# Altium project ad7768_testboard.PrjPcb
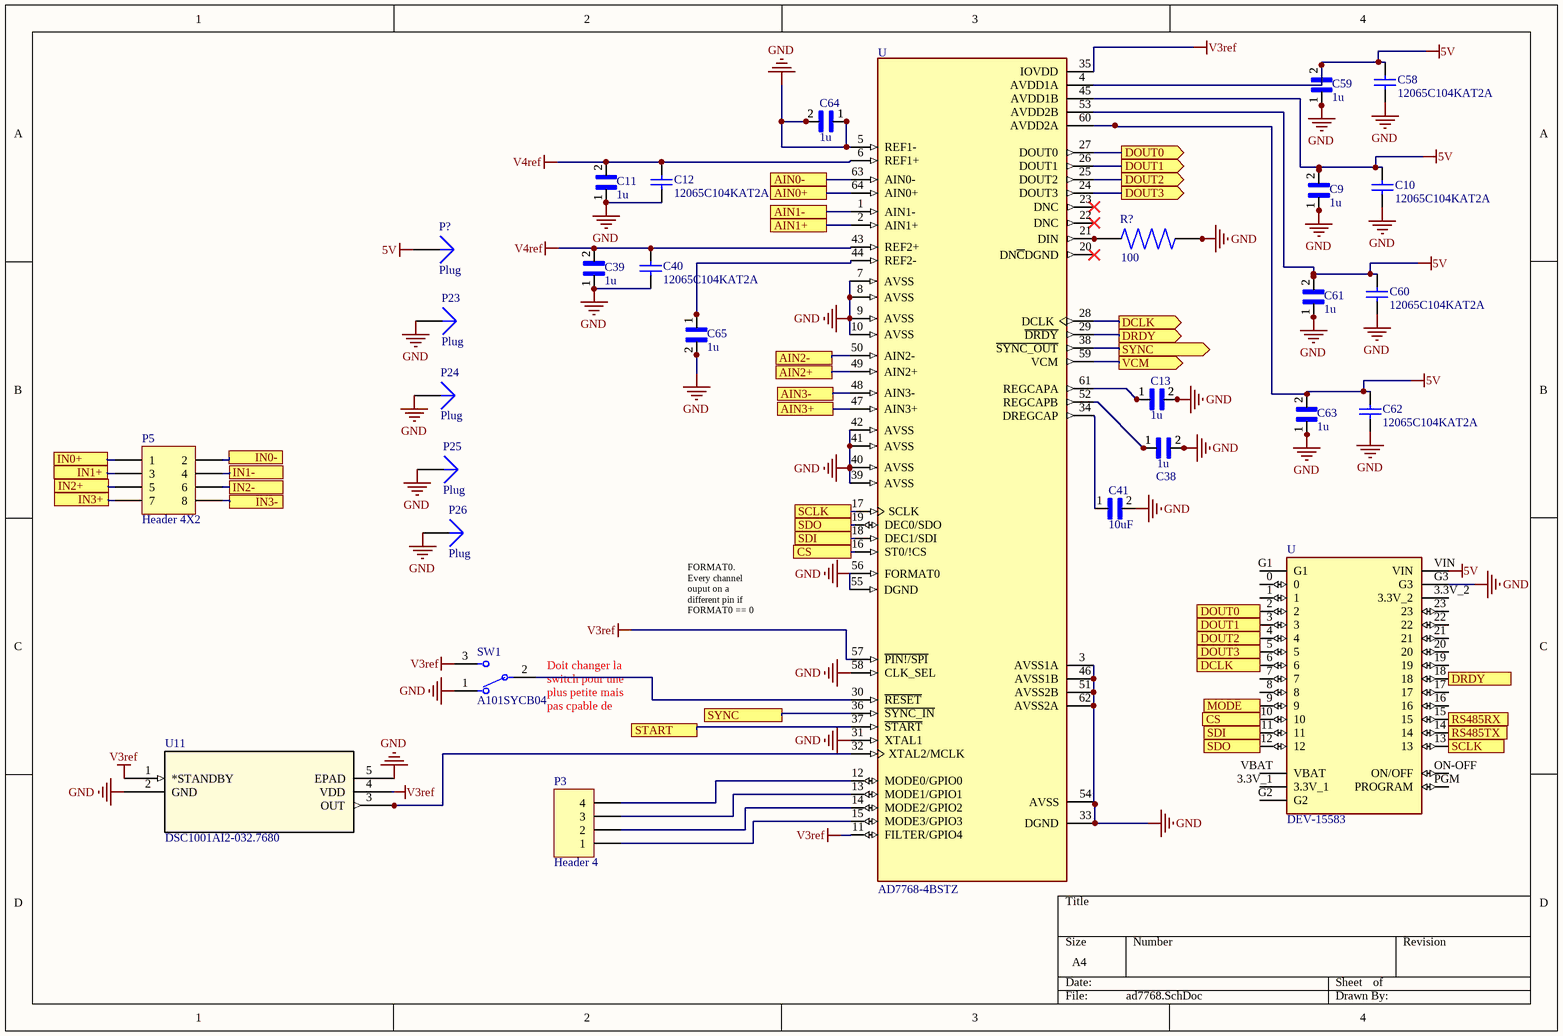
[diagram p0: ad7768.SchDoc]
4 sheets, 90 parts. Net scope: flat (ports and power ports of the same name join across sheets).
Sheets:
  ad7768.SchDoc
  Vref.SchDoc
  driver0-3.SchDoc
  thvd8000.SchDoc

## Sheet ad7768.SchDoc
size A4; SheetNumber: 1; SheetTotal: 4

### Parts
(Parts that share a designator on the sheet are numbered #1, #2 ... from top to bottom, then left to right.)
C9  1u  [CAPC3216X127N]
C10  12065C104KAT2A  [CAPC3216X94X50ML20T25]
C11  1u  [CAPC3216X127N]
C12  12065C104KAT2A  [CAPC3216X94X50ML20T25]
C13  1u  [CAPC3216X127N]
C38  1u  [CAPC3216X127N]
C39  1u  [CAPC3216X127N]
C40  12065C104KAT2A  [CAPC3216X94X50ML20T25]
C41  10uF  [CAPC3216X178N]
C58  12065C104KAT2A  [CAPC3216X94X50ML20T25]
C59  1u  [CAPC3216X127N]
C60  12065C104KAT2A  [CAPC3216X94X50ML20T25]
C61  1u  [CAPC3216X127N]
C62  12065C104KAT2A  [CAPC3216X94X50ML20T25]
C63  1u  [CAPC3216X127N]
C64  1u  [CAPC3216X127N]
C65  1u  [CAPC3216X127N]
P3  Header 4  [HDR1X4]
P5  Header 4X2  [HDR2X4]
P23  Plug  [PIN1]
P24  Plug  [PIN1]
P25  Plug  [PIN1]
P26  Plug  [PIN1]
P?  Plug  [PIN1]
R?#1  100  [RESC3116X75N]
SW1  A101SYCB04  [FP-A101SYCB04-MFG]
U11  DSC1001AI2-032.7680  [DFN4_7X5_MCH]
U#1  AD7768-4BSTZ  [QFP50P1200X1200X160-64N]
U#2  DEV-15583  [MODULE_DEV-15583]

### Ports
AIN0+, AIN0-, AIN1+, AIN1-, AIN2+, AIN2-, AIN3+, AIN3-, CS, DCLK (out), DOUT0 (out), DOUT1 (out), DOUT2 (out), DOUT3 (out), DRDY (out), IN0+, IN0-, IN1+, IN1-, IN2+, IN2-, IN3+, IN3-, MODE, RS485RX, RS485TX, SCLK, SDI, SDO, START, SYNC, SYNC (out), VCM (out)

### Nets
5V: C9.2 C10.1 C58.1 C59.2 C60.1 C61.2 C62.1 C63.2 P?.1 U#1.4(AVDD1A) U#1.45(AVDD1B) U#1.53(AVDD2B) U#1.60(AVDD2A) U#2.VIN
GND: C9.1 C10.2 C11.1 C12.2 C13.2 C38.2 C39.1 C40.2 C41.2 C58.2 C59.1 C60.2 C61.1 C62.2 C63.1 C64.1 C64.2 C65.2 P23.1 P24.1 P25.1 P26.1 R?#1.2 SW1.1 U11.2(GND) U11.5(EPAD) U#1.3(AVSS1A) U#1.5(REF1-) U#1.7(AVSS) U#1.8(AVSS) U#1.9(AVSS) U#1.10(AVSS) U#1.31(XTAL1) U#1.33(DGND) U#1.39(AVSS) U#1.40(AVSS) U#1.41(AVSS) U#1.42(AVSS) U#1.46(AVSS1B) U#1.51(AVSS2B) U#1.54(AVSS) U#1.55(DGND) U#1.56(FORMAT0) U#1.58(CLK_SEL) U#1.62(AVSS2A) U#2.G3
V3ref: SW1.3 U11.1(*STANDBY) U11.4(VDD) U#1.11(FILTER/GPIO4) U#1.35(IOVDD) U#1.57(~{PIN!/SPI})
V4ref: C11.2 C12.1 C39.2 C40.1 U#1.6(REF1+) U#1.43(REF2+)
AIN0+: U#1.64(AIN0+) ; port AIN0+
AIN0-: U#1.63(AIN0-) ; port AIN0-
AIN1+: U#1.2(AIN1+) ; port AIN1+
AIN1-: U#1.1(AIN1-) ; port AIN1-
AIN2+: U#1.49(AIN2+) ; port AIN2+
AIN2-: U#1.50(AIN2-) ; port AIN2-
AIN3+: U#1.47(AIN3+) ; port AIN3+
AIN3-: U#1.48(AIN3-) ; port AIN3-
CS: U#1.16(ST0/!CS) U#2.10 ; port CS
DCLK: U#1.28(DCLK) U#2.6 ; port DCLK
DOUT0: U#1.27(DOUT0) U#2.2 ; port DOUT0
DOUT1: U#1.26(DOUT1) U#2.3 ; port DOUT1
DOUT2: U#1.25(DOUT2) U#2.4 ; port DOUT2
DOUT3: U#1.24(DOUT3) U#2.5 ; port DOUT3
DRDY: U#1.29(~{DRDY}) U#2.18 ; port DRDY
IN0+: P5.1 ; port IN0+
IN0-: P5.2 ; port IN0-
IN1+: P5.3 ; port IN1+
IN1-: P5.4 ; port IN1-
IN2+: P5.5 ; port IN2+
IN2-: P5.6 ; port IN2-
IN3+: P5.7 ; port IN3+
IN3-: P5.8 ; port IN3-
MODE: U#2.9 ; port MODE
RS485RX: U#2.15 ; port RS485RX
RS485TX: U#2.14 ; port RS485TX
SCLK: U#1.17(SCLK) U#2.13 ; port SCLK
SDI: U#1.18(DEC1/SDI) U#2.11 ; port SDI
SDO: U#1.19(DEC0/SDO) U#2.12 ; port SDO
START: U#1.37(~{START}) ; port START
SYNC: U#1.36(~{SYNC_IN}) U#1.38(~{SYNC_OUT}) ; port SYNC
VCM: U#1.59(VCM) ; port VCM
NetC13_1: C13.1 U#1.61(REGCAPA)
NetC38_1: C38.1 U#1.52(REGCAPB)
NetC41_1: C41.1 U#1.34(DREGCAP)
NetC65_1: C65.1 U#1.44(REF2-)
NetP3_1: P3.1 U#1.15(MODE3/GPIO3)
NetP3_2: P3.2 U#1.14(MODE2/GPIO2)
NetP3_3: P3.3 U#1.13(MODE1/GPIO1)
NetP3_4: P3.4 U#1.12(MODE0/GPIO0)
NetR?#1_1: R?#1.1 U#1.21(DIN)
NetSW1_2: SW1.2 U#1.30(~{RESET})
NetU11_3: U11.3(OUT) U#1.32(XTAL2/MCLK)

Not connected (* = marked no-connect by the designer): U#1 20(DN~{C}DGND)* 22(DNC)* 23(DNC)*; U#2 0 1 3.3V_1 3.3V_2 7 8 16 17 19 20 21 22 23 G1 G2 ON-OFF(ON/OFF) PGM(PROGRAM) VBAT

### Notes on the sheet
- FORMAT0. Every channel ouput on a different pin if FORMAT0 == 0
- (near SW1) Doit changer la switch pour une plus petite mais pas cpable de trouver

### Library data of the parts
C9 C11 C13 C38 C39 C59 C61 C63-C65 = 1206YC105KAT2A: Cap Ceramic 1uF 16V X7R 10% SMD 1206 125ÂÂŽ T/R; MF: {'manufacturer': u'AVX'}; Value: *; Package: None; MP: 1206YC105KAT2A; Price: None; Availability: Unavailable
C10 C12 C40 C58 C60 C62 = CMP-2000-05018-1: Chip Capacitor, Ceramic, 100 nF, 10%, 50 V, 1206, RoHS, Tape and Reel; Manufacturer: AVX; Rated Voltage: 50V; Dielectric: X7R; Capacitance: 100nF; Datasheet URL: http://www.mouser.com/ds/2/40/cauto-360.pdf; Manufacturer URL: http://www.avx.com/; Datasheet Version: Sep-14; Tolerance (%): ±10%; Case Size/Dimension: 1206
C41 = 1206ZC106KAT2A: CAPACITOR, MLCC, X7R, 10UF, 10V, 1206; MF: {'manufacturer': u'AVX'}; Value: *; Price: None; Availability: Unavailable; MP: 1206ZC106KAT2A; Package: None
P3 = Header 4: Header, 4-Pin; LatestRevisionDate: 17-Jul-2002; LatestRevisionNote: Re-released for DXP Platform.; Publisher: Altium Limited
P5 = Header 4X2: Header, 4-Pin, Dual row; LatestRevisionDate: 17-Jul-2002; LatestRevisionNote: Re-released for DXP Platform.; Publisher: Altium Limited
R?#1 = RTAN1206BKE33R0: MF: {'manufacturer': u'Stackpole Electronics Inc'}; Value: *; Package: None; MP: RTAN1206BKE33R0; Price: None; Availability: Unavailable
SW1 = CMP-03408-000017-1: SWITCH TOGGLE SPDT 0.4VA 20V; Electrical Life: 6000Cycles; Number of Poles: 1; Power Rating: 400mW; Switch Function: On-On; Contact Resistance: 10mR; Contact Current Rating: 400mA; Actuator Material: Phenolic; Insulation Resistance: 30MR; Actuator Color: Chrome; Number of Positions: 2; Actuator Type: Standard Round; Actuator Length: 10.41mm; Illumination Type: Non-Illuminated; Flammability Rating: UL94 V-1; Contact Material: Copper; Depth: 6.86mm; Contact Plating: Gold; Voltage Rating (AC): 20V; Max Voltage Rating (DC): 20V; Min Operating Temperature: -30°C; Max Operating Temperature: 85°C; Throw Configuration: SPDT; Packaging: Bulk; Termination: PC Pins; Series: Gemini A; ELV: Compliant; Lead Free: Lead Free; RoHS Compliant: Yes; REACH SVHC: No SVHC; Mount: Panel; Orientation: Straight; Package Quantity: 100; Max Voltage Rating (AC): 20V; Radiation Hardening: No; Voltage Rating (DC): 20V
U11 = DSC1001AI2-032.7680: No Description Available; Mfr_Name: Microchip; Copyright: Copyright (C) 2021 Ultra Librarian. All rights reserved.; Manufacturer_Part_Number: DSC1001AI2-032.7680; Digi-Key_Part_Number_1: DSC1001AI2-032.7680-ND; RefDes: RefDes; Type: DEV
U#1 = AD7768-4BSTZ: 24 Bit Analog to Digital Converter 4 Input 4 Sigma-Delta 64-LQFP _10x10_; MF: Analog Devices; Digi-Key_Purchase_URL: https://www.digikey.com/product-detail/en/analog-devices-inc/AD7768-4BSTZ/AD7768-4BSTZ-ND/6072260?utm_source=snapeda&utm_medium=aggregator&utm_campaign=symbol; Package: LQFP -64 Analog Devices; SnapEDA_Link: https://www.snapeda.com/parts/AD7768-4BSTZ/Analog%20Devices%20Inc./view-part/501603/?ref=snap; Value: *; MP: AD7768-4BSTZ; Digi-Key_Part_Number: AD7768-4BSTZ-ND
U#2 = DEV-15583: RT1062 Teensy 4.0 i.MX ARMÂ® CortexÂ®-M7 MPU Embedded Evaluation Board; MF: SparkFun Electronics; Value: *; Package: None; Digi-Key_Part_Number: 1568-DEV-15583-ND; Digi-Key_Purchase_URL: https://www.digikey.com/product-detail/en/sparkfun-electronics/DEV-15583/1568-DEV-15583-ND/10384551?utm_source=snapeda&utm_medium=aggregator&utm_campaign=symbol; MP: DEV-15583; SnapEDA_Link: https://www.snapeda.com/parts/DEV-15583/SparkFun%20Electronics/view-part/4001229/?ref=snap
P23-P26 P? = Plug: LatestRevisionDate: 17-Jul-2002; LatestRevisionNote: Re-released for DXP Platform.; Publisher: Altium Limited

## Sheet Vref.SchDoc
size A4; SheetNumber: 2; SheetTotal: 4
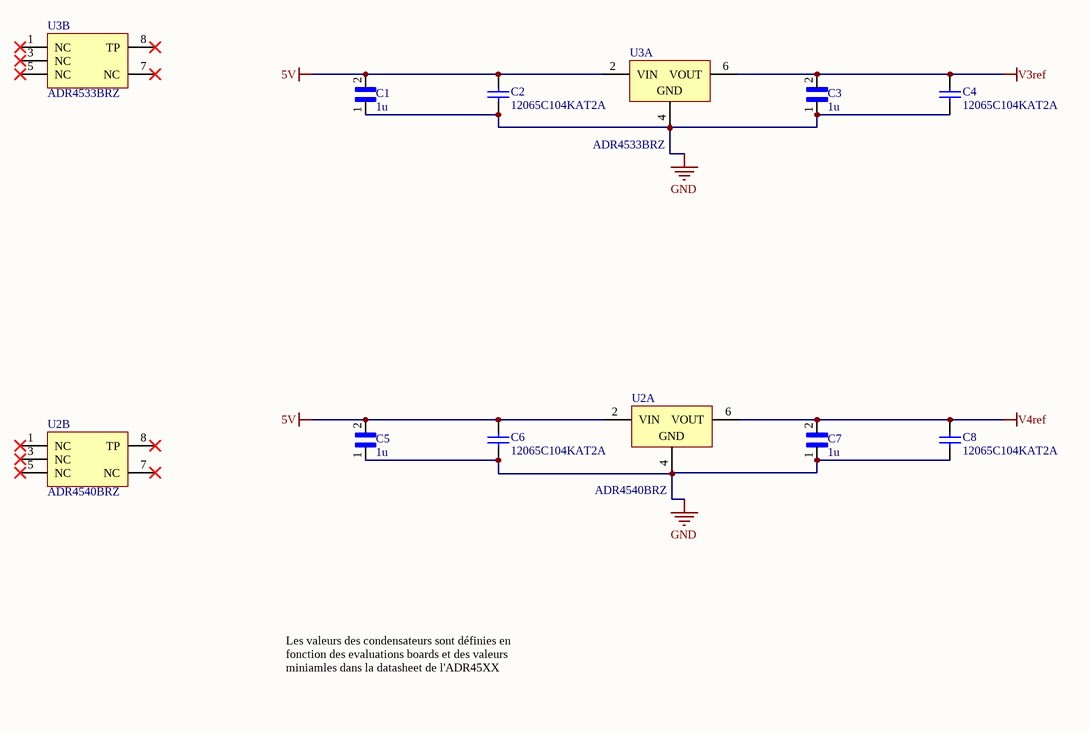
[diagram p1: Vref.SchDoc]

### Parts
C1  1u  [CAPC3216X127N]
C2  12065C104KAT2A  [CAPC3216X94X50ML20T25]
C3  1u  [CAPC3216X127N]
C4  12065C104KAT2A  [CAPC3216X94X50ML20T25]
C5  1u  [CAPC3216X127N]
C6  12065C104KAT2A  [CAPC3216X94X50ML20T25]
C7  1u  [CAPC3216X127N]
C8  12065C104KAT2A  [CAPC3216X94X50ML20T25]
U2  ADR4540BRZ  [ADI-R-8_M]  (parts A,B of 2)
U3  ADR4533BRZ  [ADI-R-8_L]  (parts A,B of 2)

### Nets
5V: C1.2 C2.1 C5.2 C6.1 U2.2(VIN) U3.2(VIN)
GND: C1.1 C2.2 C3.1 C4.2 C5.1 C6.2 C7.1 C8.2 U2.4(GND) U3.4(GND)
V3ref: C3.2 C4.1 U3.6(VOUT)
V4ref: C7.2 C8.1 U2.6(VOUT)

Not connected (* = marked no-connect by the designer): U2 1(NC)* 3(NC)* 5(NC)* 7(NC)* 8(TP)*; U3 1(NC)* 3(NC)* 5(NC)* 7(NC)* 8(TP)*

### Notes on the sheet
- Les valeurs des condensateurs sont définies en fonction des evaluations boards et des valeurs miniamles dans la datasheet de l'ADR45XX

### Library data of the parts
C1 C3 C5 C7 = 1206YC105KAT2A: as C9 on sheet ad7768; Value: *; Package: None; MP: 1206YC105KAT2A; Price: None; Availability: Unavailable
C2 C4 C6 C8 = CMP-2000-05018-1: as C10 on sheet ad7768; Datasheet URL: http://www.mouser.com/ds/2/40/cauto-360.pdf; Manufacturer URL: http://www.avx.com/; Datasheet Version: Sep-14; Tolerance (%): ±10%; Case Size/Dimension: 1206
U2 = CMP-0784-00192-1: Ultralow Noise, High Accuracy Voltage Reference, 4.096 V Output, 3 to 15 V Supply, Industrial, 8-pin SOIC (R-8), Tube; Manufacturer: Analog Devices; Max V Supply (V): 15; Min V Supply (V): 3; Vout: 4.096V; Ref Out TC (ppm/C): 2; ComponentLink4URL: Product URL:http://www.analog.com/en/special-linear-functions/voltage-references/adr4540/products/product.html; Mounting Technology: Surface Mount; ComponentLink1Description: Manufacturer URL; PackageDescription: 8-Pin Standard Small Outline Package, Body 4.9 x 3.9 mm, Pitch 1.27 mm; ComponentLink2URL: http://www.analog.com/static/imported-files/data_sheets/ADR4520_4525_4530_4533_4540_4550.pdf; ComponentLink1URL: http://www.analog.com/en/index.html; DatasheetVersion: Rev. 0; ComponentLink4Description: URL Link1; Operating Temp Range: -40 to 125 degC; PartNumber: ADR4540BRZ; ComponentLink2Description: Datasheet; ComponentLink3URL: http://www.analog.com/static/imported-files/packages/PKG_PDF/SOIC_Narrow%20(R)/R_8.pdf; ComponentLink3Description: Package Specification; PackageVersion: 060506-A, 06/2006; Packing: Tube; PackageReference: R-8; Code_JEDEC: MS-012-AA
U3 = CMP-0784-00188-1: Ultralow Noise, High Accuracy Voltage Reference, 3.3 V Output, 3 to 15 V Supply, Industrial, 8-pin SOIC (R-8), Tube; Manufacturer: Analog Devices; Min V Supply (V): 3; Ref Out TC (ppm/C): 2; Max V Supply (V): 15; Vout: 3.3V; ComponentLink1URL: http://www.analog.com/en/index.html; ComponentLink3Description: Package Specification; Operating Temp Range: -40 to 125 degC; PartNumber: ADR4533BRZ; DatasheetVersion: Rev. 0; ComponentLink3URL: http://www.analog.com/static/imported-files/packages/PKG_PDF/SOIC_Narrow%20(R)/R_8.pdf; Packing: Tube; ComponentLink2URL: http://www.analog.com/static/imported-files/data_sheets/ADR4520_4525_4530_4533_4540_4550.pdf; Code_JEDEC: MS-012-AA; PackageVersion: 060506-A, 06/2006; ComponentLink4Description: URL Link1; ComponentLink1Description: Manufacturer URL; PackageReference: R-8; ComponentLink4URL: Product URL:http://www.analog.com/en/special-linear-functions/voltage-references/adr4533/products/product.html; PackageDescription: 8-Pin Standard Small Outline Package, Body 4.9 x 3.9 mm, Pitch 1.27 mm; ComponentLink2Description: Datasheet; Mounting Technology: Surface Mount

## Sheet driver0-3.SchDoc
size A4; SheetNumber: 3; SheetTotal: 4
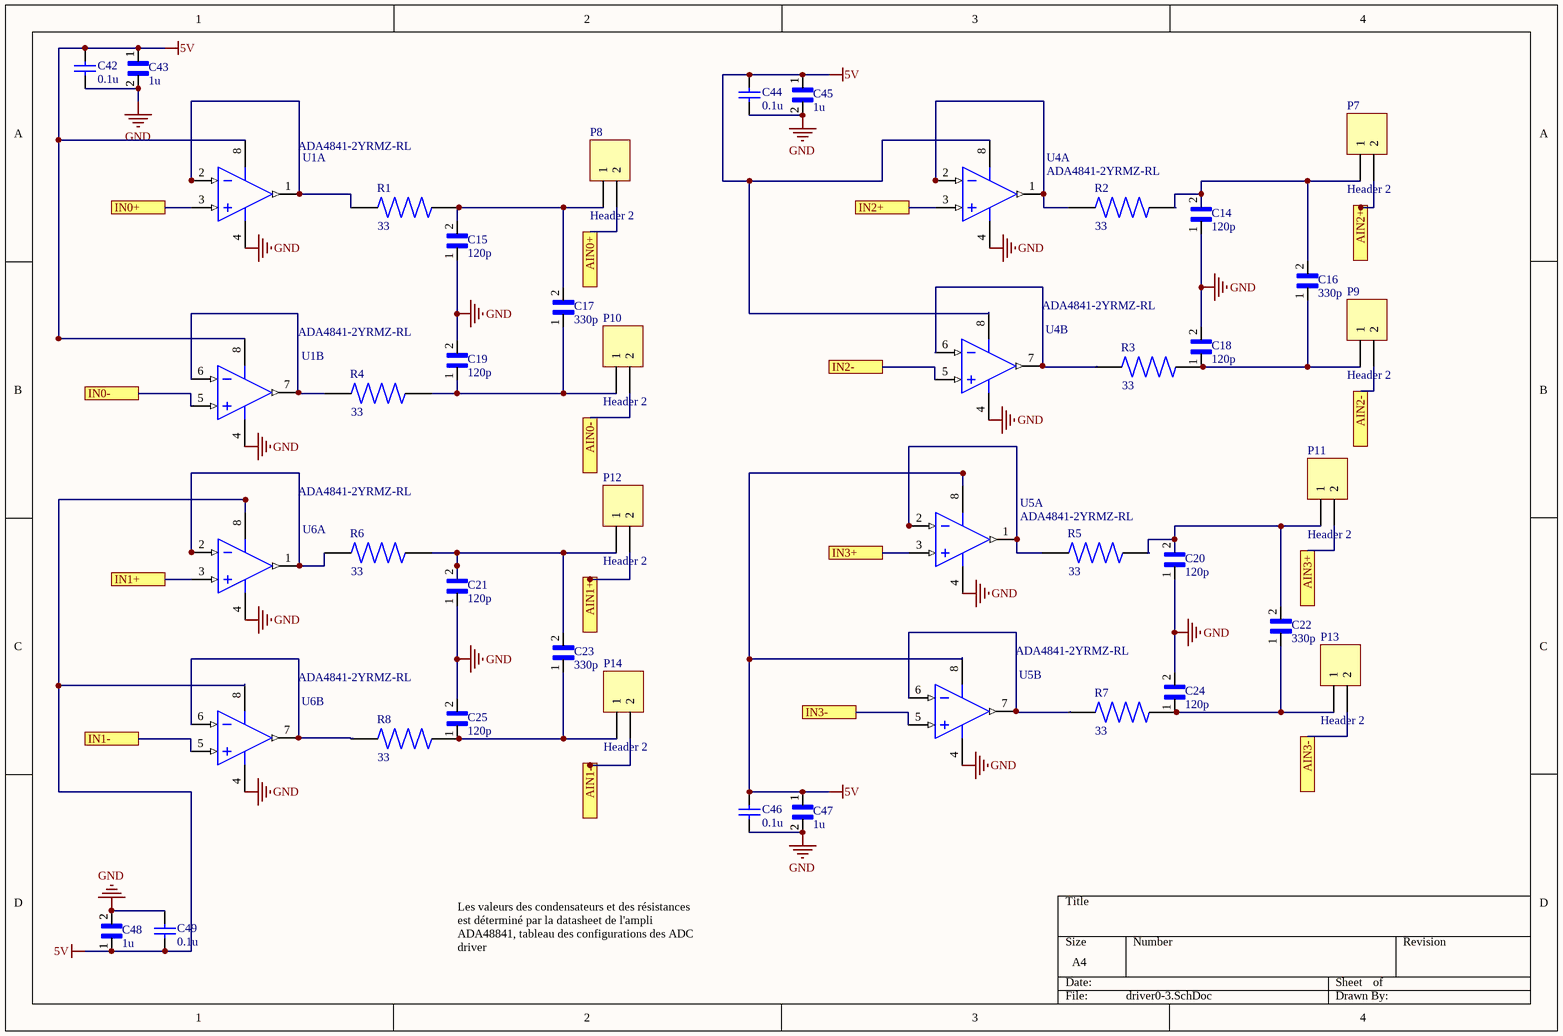
[diagram p2: driver0-3.SchDoc]

### Parts
C14  120p  [CAPC3216X94N]
C15  120p  [CAPC3216X94N]
C16  330p  [CAPC3216X94N]
C17  330p  [CAPC3216X94N]
C18  120p  [CAPC3216X94N]
C19  120p  [CAPC3216X94N]
C20  120p  [CAPC3216X94N]
C21  120p  [CAPC3216X94N]
C22  330p  [CAPC3216X94N]
C23  330p  [CAPC3216X94N]
C24  120p  [CAPC3216X94N]
C25  120p  [CAPC3216X94N]
C42  0.1u  [CAPC3216X94X50ML20T25]
C43  1u  [CAPC3216X127N]
C44  0.1u  [CAPC3216X94X50ML20T25]
C45  1u  [CAPC3216X127N]
C46  0.1u  [CAPC3216X94X50ML20T25]
C47  1u  [CAPC3216X127N]
C48  1u  [CAPC3216X127N]
C49  0.1u  [CAPC3216X94X50ML20T25]
P7  Header 2  [HDR1X2]
P8  Header 2  [HDR1X2]
P9  Header 2  [HDR1X2]
P10  Header 2  [HDR1X2]
P11  Header 2  [HDR1X2]
P12  Header 2  [HDR1X2]
P13  Header 2  [HDR1X2]
P14  Header 2  [HDR1X2]
R1  33  [RESC3116X75N]
R2  33  [RESC3116X75N]
R3  33  [RESC3116X75N]
R4  33  [RESC3116X75N]
R5  33  [RESC3116X75N]
R6  33  [RESC3116X75N]
R7  33  [RESC3116X75N]
R8  33  [RESC3116X75N]
U1  ADA4841-2YRMZ-RL  [ADI-RM-8_M]  (parts A,B of 2)
U4  ADA4841-2YRMZ-RL  [ADI-RM-8_M]  (parts A,B of 2)
U5  ADA4841-2YRMZ-RL  [ADI-RM-8_M]  (parts A,B of 2)
U6  ADA4841-2YRMZ-RL  [ADI-RM-8_M]  (parts A,B of 2)

### Ports
AIN0+, AIN0-, AIN1+, AIN1-, AIN2+, AIN2-, AIN3+, AIN3-, IN0+, IN0-, IN1+, IN1-, IN2+, IN2-, IN3+, IN3-

### Nets
5V: C42.1 C43.1 C44.1 C45.1 C46.1 C47.1 C48.1 C49.1 U1.8(+VS) U4.8(+VS) U5.8(+VS) U6.8(+VS)
GND: C14.1 C15.1 C18.2 C19.2 C20.1 C21.1 C24.2 C25.2 C42.2 C43.2 C44.2 C45.2 C46.2 C47.2 C48.2 C49.2 U1.4(-VS) U4.4(-VS) U5.4(-VS) U6.4(-VS)
AIN0+: P8.2 ; port AIN0+
AIN0-: P10.2 ; port AIN0-
AIN1+: P12.2 ; port AIN1+
AIN1-: P14.2 ; port AIN1-
AIN2+: P7.2 ; port AIN2+
AIN2-: P9.2 ; port AIN2-
AIN3+: P11.2 ; port AIN3+
AIN3-: P13.2 ; port AIN3-
IN0+: U1.3(+IN_1) ; port IN0+
IN0-: U1.5(+IN_2) ; port IN0-
IN1+: U6.3(+IN_1) ; port IN1+
IN1-: U6.5(+IN_2) ; port IN1-
IN2+: U4.3(+IN_1) ; port IN2+
IN2-: U4.5(+IN_2) ; port IN2-
IN3+: U5.3(+IN_1) ; port IN3+
IN3-: U5.5(+IN_2) ; port IN3-
NetC14_2: C14.2 C16.2 P7.1 R2.2
NetC15_2: C15.2 C17.2 P8.1 R1.2
NetC16_1: C16.1 C18.1 P9.1 R3.2
NetC17_1: C17.1 C19.1 P10.1 R4.2
NetC20_2: C20.2 C22.2 P11.1 R5.2
NetC21_2: C21.2 C23.2 P12.1 R6.2
NetC22_1: C22.1 C24.1 P13.1 R7.2
NetC23_1: C23.1 C25.1 P14.1 R8.2
NetR1_1: R1.1 U1.1(OUT_1) U1.2(-IN_1)
NetR2_1: R2.1 U4.1(OUT_1) U4.2(-IN_1)
NetR3_1: R3.1 U4.6(-IN_2) U4.7(OUT_2)
NetR4_1: R4.1 U1.6(-IN_2) U1.7(OUT_2)
NetR5_1: R5.1 U5.1(OUT_1) U5.2(-IN_1)
NetR6_1: R6.1 U6.1(OUT_1) U6.2(-IN_1)
NetR7_1: R7.1 U5.6(-IN_2) U5.7(OUT_2)
NetR8_1: R8.1 U6.6(-IN_2) U6.7(OUT_2)

### Notes on the sheet
- Les valeurs des condensateurs et des résistances est déterminé par la datasheet de l'ampli ADA48841, tableau des configurations des ADC driver

### Library data of the parts
C14 C15 C18-C21 C24 C25 = 12061A121JAT2A: CERAMIC CAPACITOR 120PF 100V, C0G, 5%, 1206; MF: {'manufacturer': u'AVX'}; Value: *; Package: None; MP: 12061A121JAT2A; Price: None; Availability: Unavailable
C16 C17 C22 C23 = 12065A331JAT2A: Ceramic Multilayer Capacitor; Capacitor Type:General Purpose; Capacitance:330pF; Capacitance Tolerance:Â± 5%; Voltage Rating:50VDC; Capacitor Dielectric Type:Multilayer Ceramic; Package/Case:1206; Termination Type:SMD ;RoHS Compliant: Yes; MF: {'manufacturer': u'AVX'}; Value: *; Package: None; MP: 12065A331JAT2A; Price: None; Availability: Unavailable
C42 C44 C46 C49 = CMP-2000-05018-1: as C10 on sheet ad7768; Datasheet URL: http://www.mouser.com/ds/2/40/cauto-360.pdf; Manufacturer URL: http://www.avx.com/; Datasheet Version: Sep-14; Tolerance (%): ±10%; Case Size/Dimension: 1206
C43 C45 C47 C48 = 1206YC105KAT2A: as C9 on sheet ad7768; Value: *; Package: None; MP: 1206YC105KAT2A; Price: None; Availability: Unavailable
P7-P14 = Header 2: Header, 2-Pin; LatestRevisionDate: 17-Jul-2002; LatestRevisionNote: Re-released for DXP Platform.; Publisher: Altium Limited
R1-R8 = RTAN1206BKE33R0: as R?#1 on sheet ad7768; Value: *; Package: None; MP: RTAN1206BKE33R0; Price: None; Availability: Unavailable
U1 U4-U6 = CMP-0384-01677-1: Double Channel Low Wide Band Noise Operational Amplifier, 80 MHz BW, 13 V/us SR, Industrial, 8-pin SOP (RM-8), Reel; Manufacturer: Analog Devices; Slew Rate: 13V/us; Iq/Amp: 1.5mA; Amplifiers Per Package: 2; Small Signal Bandwidth: 80MHz; V Span Min: 2.7V; V Span Max: 12V; Input Offset Voltage: 40uV; Input Bias Current: 3uA; ComponentLink3URL: http://www.analog.com/static/imported-files/packages/PKG_PDF/MSOP%28RM%29/RM_8.pdf; PartNumber: ADA4841-2YRMZ-RL; Mounting Technology: Surface Mount; DatasheetVersion: Rev. E; PackageDescription: 8-Pin Mini Small Outline Package, Body 3 x 3 mm, Pitch 0.65 mm; PackageReference: RM-8; ComponentLink2URL: http://www.analog.com/static/imported-files/data_sheets/ADA4841-1_4841-2.pdf; ComponentLink1Description: Manufacturer URL; ComponentLink2Description: Datasheet; Generic Part Number: ADA4841-2; ComponentLink1URL: http://www.analog.com/en/index.html; Code_JEDEC: MO-187-AA; ComponentLink3Description: Package Specification

## Sheet thvd8000.SchDoc
size A4; SheetNumber: 4; SheetTotal: 4
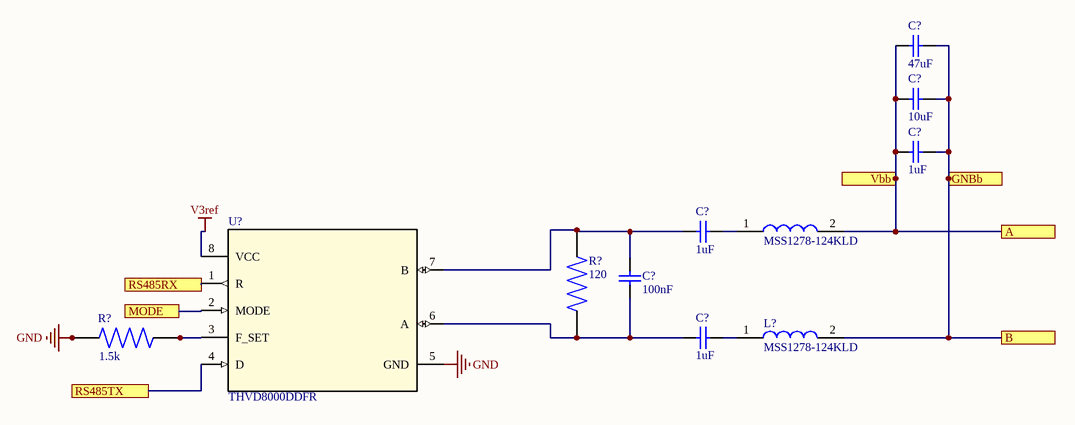
[diagram p3: thvd8000.SchDoc]

### Parts
(Parts that share a designator on the sheet are numbered #1, #2 ... from top to bottom, then left to right.)
C?#1  47uF  [CAPC3216X94X50ML20T25]
C?#2  10uF  [CAPC3216X94X50ML20T25]
C?#3  1uF  [CAPC3216X94X50ML20T25]
C?#4  1uF  [CAPC3216X94X50ML20T25]
C?#5  100nF  [CAPC3216X94X50ML20T25]
C?#6  1uF  [CAPC3216X94X50ML20T25]
L?  MSS1278-124KLD  [INDPM120120X805N]
R?#2  120  [RESC3116X75N]
R?#3  1.5k  [RESC3116X75N]
U?  THVD8000DDFR  [DDF0008A-IPC_A]
  MSS1278-124KLD  [INDPM120120X805N]

### Ports
A, B, GNBb, MODE, RS485RX, RS485TX, Vbb

### Nets
GND: R?#3.1 U?.5(GND)
V3ref: U?.8(VCC)
A: C?#1.1 C?#2.1 C?#3.1 .2 ; port Vbb, port A
B: C?#1.2 C?#2.2 C?#3.2 L?.2 ; port GNBb, port B
MODE: U?.2(MODE) ; port MODE
RS485RX: U?.1(R) ; port RS485RX
RS485TX: U?.4(D) ; port RS485TX
NetC?#4_1: C?#4.1 C?#5.1 R?#2.2 U?.7(B)
NetC?#4_2: C?#4.2 .1
NetC?#5_2: C?#5.2 C?#6.1 R?#2.1 U?.6(A)
NetC?#6_2: C?#6.2 L?.1
NetR?#3_2: R?#3.2 U?.3(F_SET)

### Library data of the parts
C?#1-C?#4 C?#6 = CMP-2000-05018-1: as C10 on sheet ad7768; Datasheet URL: http://www.mouser.com/ds/2/40/cauto-360.pdf; Manufacturer URL: http://www.avx.com/; Datasheet Version: Sep-14; Tolerance (%): ±10%; Case Size/Dimension: 1206
C?#5 = CMP-2000-05018-1: Chip Capacitor, Ceramic, 100 nF, 10%, 50 V, 1206, RoHS, Tape and Reel; Manufacturer: AVX; Rated Voltage: 50V; Dielectric: X7R; Datasheet URL: http://www.mouser.com/ds/2/40/cauto-360.pdf; Capacitance: 100nF; Manufacturer URL: http://www.avx.com/; Datasheet Version: Sep-14; Tolerance (%): ±10%; Case Size/Dimension: 1206
L?  = MSS1278-124KLD: Inductor; Manufacturer_Name: COILCRAFT; Datasheet Link: https://componentsearchengine.com/Datasheets/1/MSS1278-124KLD.pdf; Height: 8.05mm; Manufacturer_Part_Number: MSS1278-124KLD
R?#2 R?#3 = RTAN1206BKE33R0: as R?#1 on sheet ad7768; Value: *; Package: None; MP: RTAN1206BKE33R0; Price: None; Availability: Unavailable
U? = THVD8000DDFR: No Description Available; Mfr_Name: Texas Instruments; Type: DEV; RefDes: RefDes; Copyright: Copyright (C) 2021 Ultra Librarian. All rights reserved.; Manufacturer_Part_Number: THVD8000DDFR

## Nets that join several sheets
5V: ad7768 (14 pins), Vref (6 pins), driver0-3 (12 pins)
GND: ad7768 (46 pins), Vref (10 pins), driver0-3 (20 pins), thvd8000 (R?#3.1 U?.5)
V3ref: ad7768 (6 pins), Vref (C3.2 C4.1 U3.6), thvd8000 (U?.8)
V4ref: ad7768 (6 pins), Vref (C7.2 C8.1 U2.6)
AIN0+: ad7768 (U#1.64), driver0-3 (P8.2)
AIN0-: ad7768 (U#1.63), driver0-3 (P10.2)
AIN1+: ad7768 (U#1.2), driver0-3 (P12.2)
AIN1-: ad7768 (U#1.1), driver0-3 (P14.2)
AIN2+: ad7768 (U#1.49), driver0-3 (P7.2)
AIN2-: ad7768 (U#1.50), driver0-3 (P9.2)
AIN3+: ad7768 (U#1.47), driver0-3 (P11.2)
AIN3-: ad7768 (U#1.48), driver0-3 (P13.2)
IN0+: ad7768 (P5.1), driver0-3 (U1.3)
IN0-: ad7768 (P5.2), driver0-3 (U1.5)
IN1+: ad7768 (P5.3), driver0-3 (U6.3)
IN1-: ad7768 (P5.4), driver0-3 (U6.5)
IN2+: ad7768 (P5.5), driver0-3 (U4.3)
IN2-: ad7768 (P5.6), driver0-3 (U4.5)
IN3+: ad7768 (P5.7), driver0-3 (U5.3)
IN3-: ad7768 (P5.8), driver0-3 (U5.5)
MODE: ad7768 (U#2.9), thvd8000 (U?.2)
RS485RX: ad7768 (U#2.15), thvd8000 (U?.1)
RS485TX: ad7768 (U#2.14), thvd8000 (U?.4)